# EasyEDA Pro project ProPrj_国赛G题输出板_2025-08-02.epro

# Schematic Schematic1
Board Name: Board1; Create Date: 2025-07-30; Page Name: P1; Project Name: 国赛G题输出板; Schematic Name: Schematic1; Update Date: 2025-07-31; Company: 嘉立创EDA; Page Size: A4; Version: V1.0
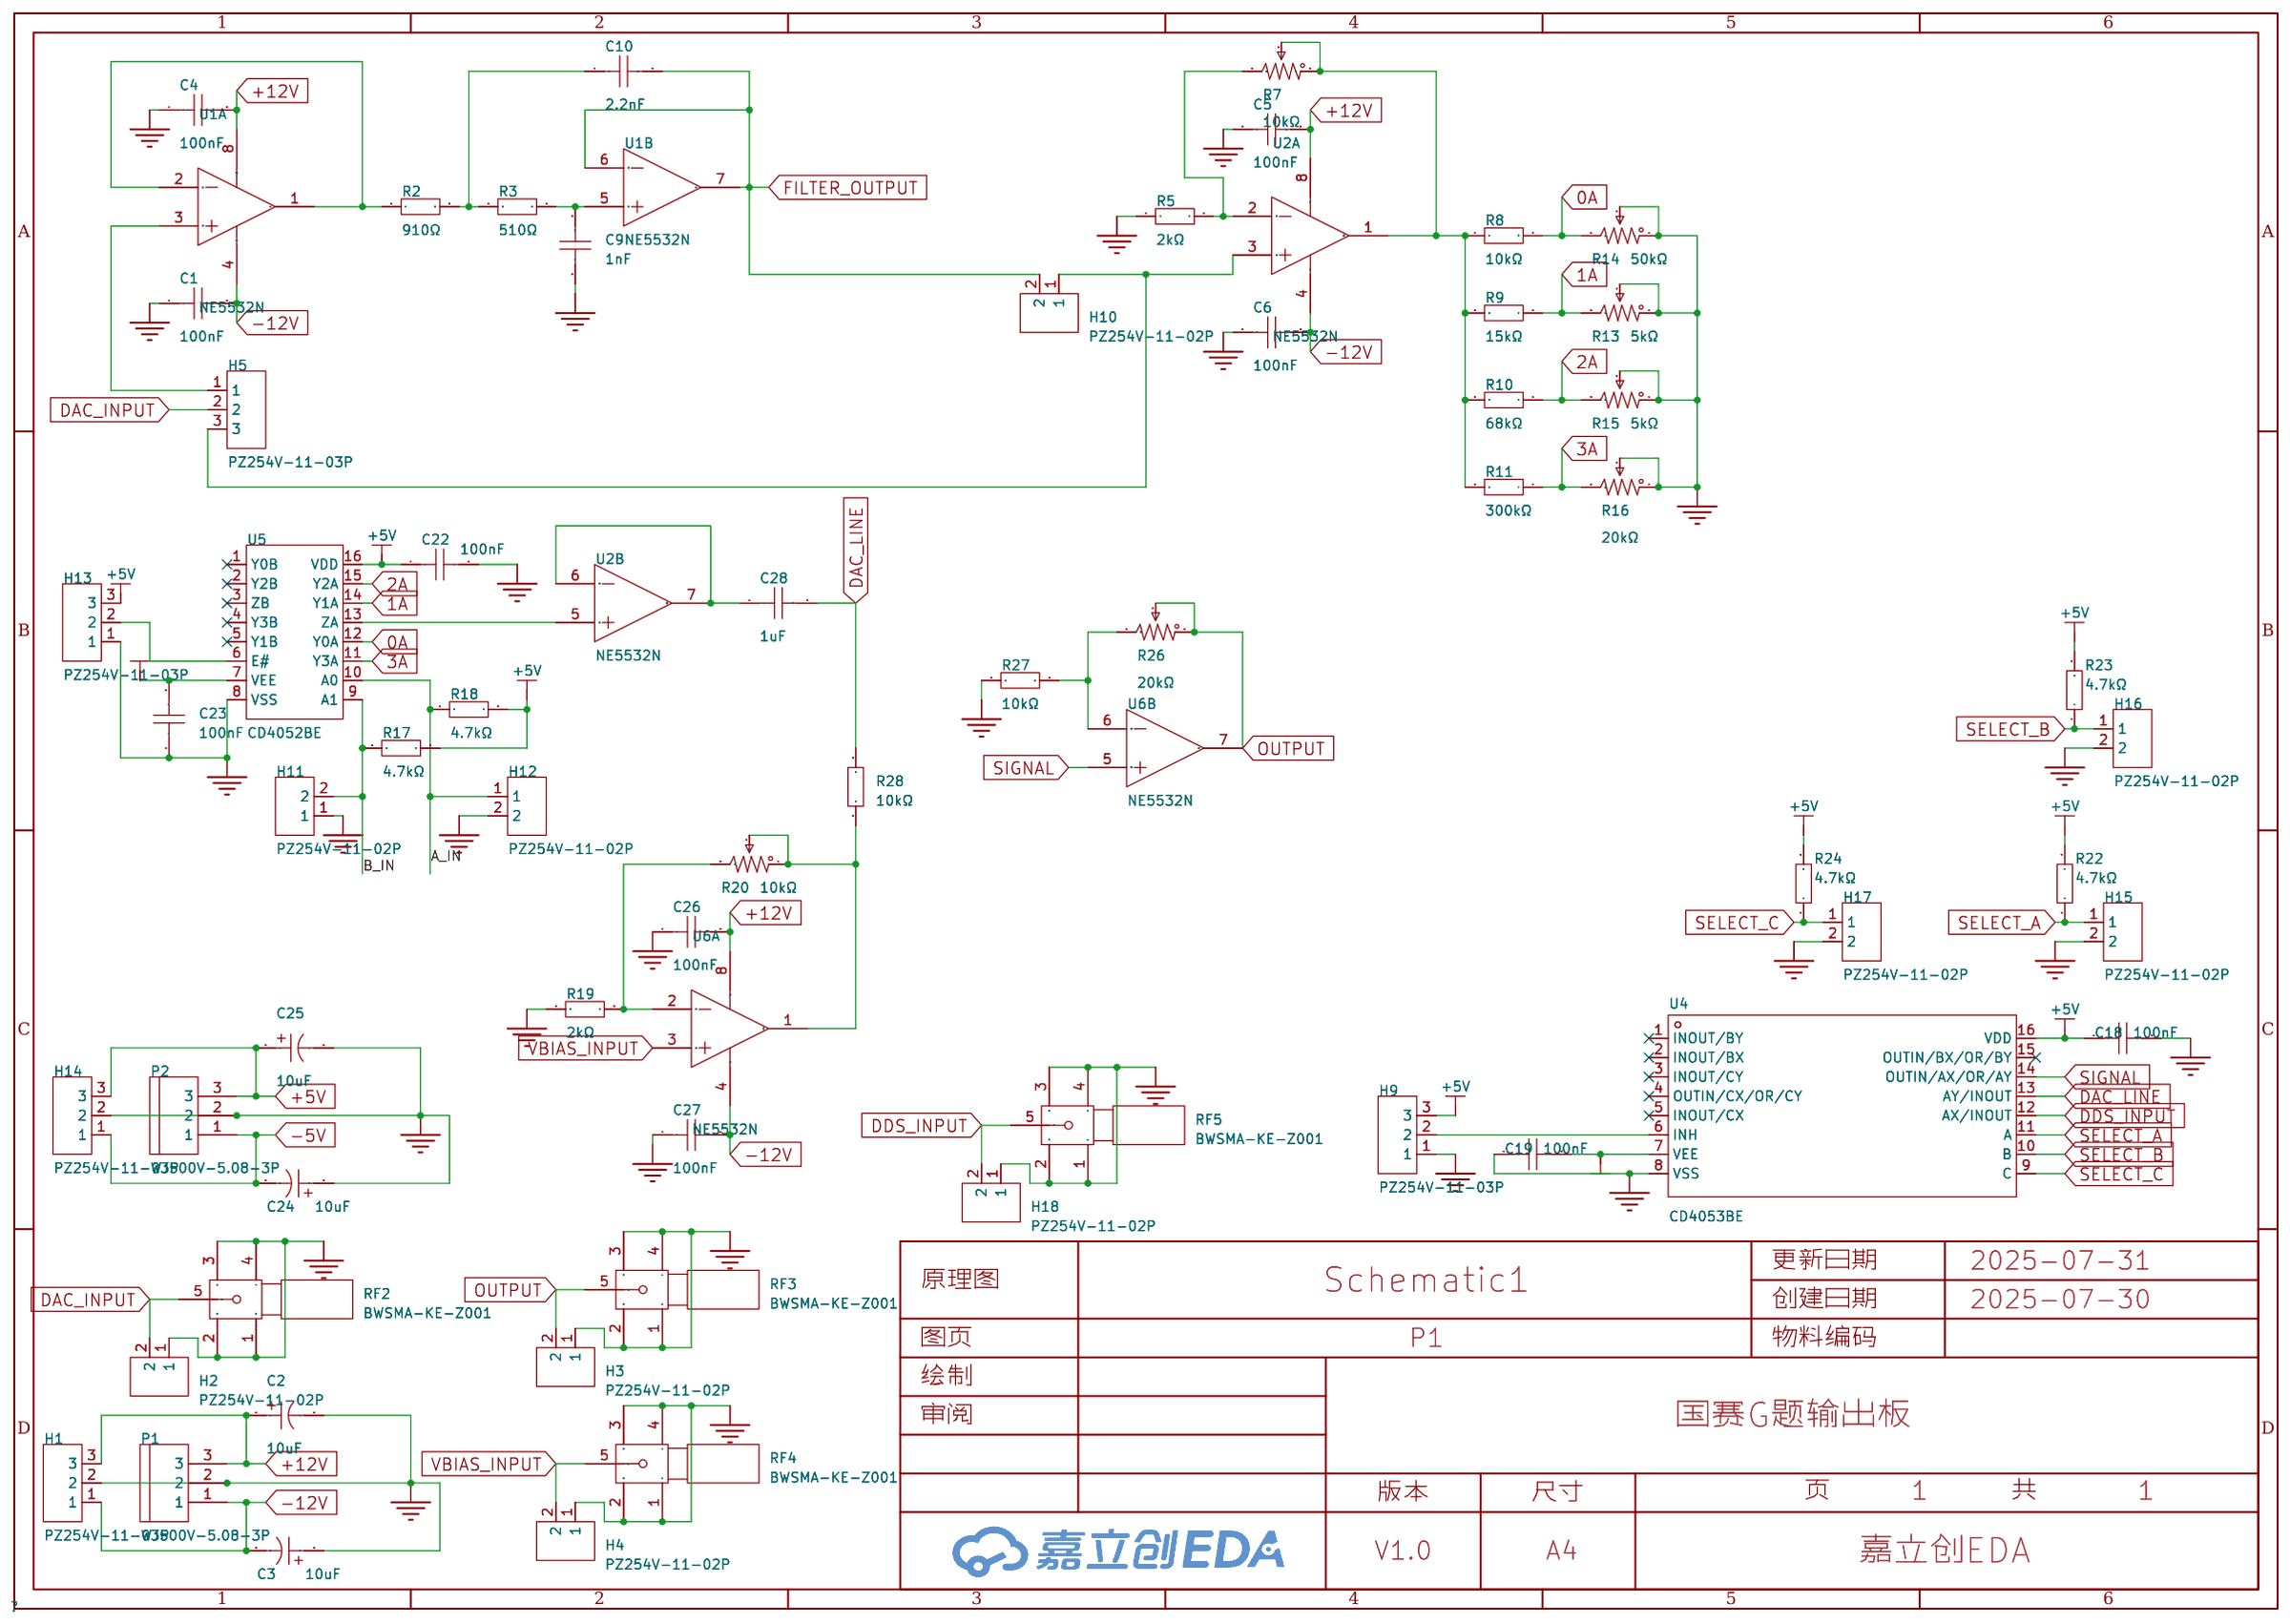
[diagram p0: schematic sheet]

## Parts
C1  100nF  [CAP-TH_L5.8-W2.4-P2.54-D0.6]
C2  10uF  [CAP-TH_BD10.0-P5.00-D0.6-FD_1]
C3  10uF  [CAP-TH_BD10.0-P5.00-D0.6-FD_1]
C4  100nF  [CAP-TH_L5.8-W2.4-P2.54-D0.6]
C5  100nF  [CAP-TH_L5.8-W2.4-P2.54-D0.6]
C6  100nF  [CAP-TH_L5.8-W2.4-P2.54-D0.6]
C9  1nF  [CAP-TH_L6.8-W2.6-P5.08-D0.6-S2.1]
C10  2.2nF  [CAP-TH_L6.0-W3.0-P5.00-D1.0]
C18  100nF  [CAP-TH_L5.0-W2.5-P5.00-D1.0]
C19  100nF  [CAP-TH_L5.0-W2.5-P5.00-D1.0]
C22  100nF  [CAP-TH_L5.8-W2.4-P2.54-D0.6]
C23  100nF  [CAP-TH_L5.8-W2.4-P2.54-D0.6]
C24  10uF  [CAP-TH_BD10.0-P5.00-D0.6-FD_1]
C25  10uF  [CAP-TH_BD10.0-P5.00-D0.6-FD_1]
C26  100nF  [CAP-TH_L5.8-W2.4-P2.54-D0.6]
C27  100nF  [CAP-TH_L5.8-W2.4-P2.54-D0.6]
C28  1uF  [CAP-TH_L5.5-W3.5-P5.00-D1.2]
H1  PZ254V-11-03P  [HDR-TH_3P-P2.54-V-M]
H2  PZ254V-11-02P  [HDR-TH_2P-P2.54-V-M]
H3  PZ254V-11-02P  [HDR-TH_2P-P2.54-V-M]
H4  PZ254V-11-02P  [HDR-TH_2P-P2.54-V-M]
H5  PZ254V-11-03P  [HDR-TH_3P-P2.54-V-M]
H9  PZ254V-11-03P  [HDR-TH_3P-P2.54-V-M]
H10  PZ254V-11-02P  [HDR-TH_2P-P2.54-V-M]
H11  PZ254V-11-02P  [HDR-TH_2P-P2.54-V-M]
H12  PZ254V-11-02P  [HDR-TH_2P-P2.54-V-M]
H13  PZ254V-11-03P  [HDR-TH_3P-P2.54-V-M]
H14  PZ254V-11-03P  [HDR-TH_3P-P2.54-V-M]
H15  PZ254V-11-02P  [HDR-TH_2P-P2.54-V-M]
H16  PZ254V-11-02P  [HDR-TH_2P-P2.54-V-M]
H17  PZ254V-11-02P  [HDR-TH_2P-P2.54-V-M]
H18  PZ254V-11-02P  [HDR-TH_2P-P2.54-V-M]
P1  WJ500V-5.08-3P  [CONN-TH_3P-P5.00_WJ500V-5.08-3P]
P2  WJ500V-5.08-3P  [CONN-TH_3P-P5.00_WJ500V-5.08-3P]
R2  910Ω  [Res_1/8W]
R3  510Ω  [Res_1/8W]
R5  2kΩ  [Res_1/8W]
R7  10kΩ  [RES-ADJ-TH_3P-L10.0-W10.0-P2.50-L]
R8  10kΩ  [Res_1/8W]
R9  15kΩ  [Res_1/8W]
R10  68kΩ  [Res_1/8W]
R11  300kΩ  [Res_1/8W]
R13  5kΩ  [RES-ADJ-TH_3P-L9.5-W4.85-P2.50-BL-BS]
R14  50kΩ  [RES-ADJ-TH_3P-L9.5-W4.85-P2.50-BL-BS]
R15  5kΩ  [RES-ADJ-TH_3P-L9.5-W4.85-P2.50-BL-BS]
R16  20kΩ  [RES-ADJ-TH_3P-L10.0-W10.0-P2.50-BL-BS]
R17  4.7kΩ  [Res_1/8W]
R18  4.7kΩ  [Res_1/8W]
R19  2kΩ  [Res_1/8W]
R20  10kΩ  [RES-ADJ-TH_3P-L10.0-W10.0-P2.50-L]
R22  4.7kΩ  [Res_1/8W]
R23  4.7kΩ  [Res_1/8W]
R24  4.7kΩ  [Res_1/8W]
R26  20kΩ  [RES-ADJ-TH_3P-L10.0-W10.0-P2.50-BL-BS]
R27  10kΩ  [Res_1/8W]
R28  10kΩ  [Res_1/8W]
RF2  BWSMA-KE-Z001  [SMA-TH_BWSMA-KE-Z001]
RF3  BWSMA-KE-Z001  [SMA-TH_BWSMA-KE-Z001]
RF4  BWSMA-KE-Z001  [SMA-TH_BWSMA-KE-Z001]
RF5  BWSMA-KE-Z001  [SMA-TH_BWSMA-KE-Z001]
U1  NE5532N  [DIP-8_L9.3-W6.4-P2.54-LS7.6-BL]  (sections 1,2)
U2  NE5532N  [DIP-8_L9.3-W6.4-P2.54-LS7.6-BL]  (sections 1,2)
U4  CD4053BE  [DIP-16_L20.3-W10.2-P2.54-LS10.2-BL]
U5  CD4052BE  [DIP-16_L20.0-W6.4-P2.54-LS7.6-BL]
U6  NE5532N  [DIP-8_L9.3-W6.4-P2.54-LS7.6-BL]  (sections 1,2)

## Library data of the parts
C1 C4-C6 C22 C23 C26 C27 = CC1H104ZA1ED3F5P1100: 容值:100nF;精度:-20%~+80%;额定电压:50V;温度系数:Y5V;; LCSC Part Name: 100nF -20%~+80% 50V; Supplier Part: C2832506; Manufacturer: Dersonic(德尔创); Supplier Footprint: 插件,P=2.54mm; JLCPCB Part Class: Extended Part; Datasheet: https://atta.szlcsc.com/upload/public/pdf/source/20211027/619020FDD8EBC9BBFCA73A5584FA164D.pdf; Supplier: LCSC; Tolerance: -20%~+80%; Voltage Rated: 50V; Lead Spacing: 2.54mm; Temperature Coefficient: Y5V; φD: 5.8mm; Body Thickness: 2.4mm
C2 C3 C24 C25 = ERG450V10M10x16: 容值:10uF;精度:±20%;额定电压:450V;纹波电流:100mA@100kHz;等效串联电阻(ESR):9.45Ω@100kHz;; LCSC Part Name: 10uF ±20% 450V; Supplier Part: C46552835; Manufacturer: 捷而瑞; Supplier Footprint: 插件,D10xL16mm; JLCPCB Part Class: Extended Part; Datasheet: https://atta.szlcsc.com/upload/public/pdf/source/20250526/717B4C76834FE5C4A331D19A222D031C.pdf; Supplier: LCSC; Tolerance: ±20%; Voltage Rating: 450V; Ripple Current: 100mA@100kHz; Equivalent Series Resistance(ESR): 9.45Ω@100kHz; Pin Spacing: 5mm; Diameter: 10mm; Height - Seated (Max): 16mm; Lifetime: 2000hrs@105℃; Operating Temperature: -25℃~+105℃
C9 = CC3D102KC2IEB46U31MF: 容值:1nF;精度:±10%;额定电压:2kV;温度系数:Y5P;; LCSC Part Name: 1nF ±10% 2kV; Supplier Part: C2976624; Manufacturer: Dersonic(德尔创); Supplier Footprint: 插件,P=5.08mm; JLCPCB Part Class: 扩展库; Datasheet: https://atta.szlcsc.com/upload/public/pdf/source/20220304/B30716485B36DF2A2600FFFEA050A940.pdf; Supplier: LCSC; Tolerance: ±10%; Voltage Rating: 2kV; Pin Spacing: 5.08mm; Temperature Coefficient: Y5P; Diameter: 6.8mm; Body Thickness: 2.6mm
C10 = R06F1B222MN0B0S0N0: 容值:2.2nF;精度:±20%;额定电压:2kV;温度系数:Y5V;; LCSC Part Name: 2.2nF ±20% 2kV; Supplier Part: C249167; Manufacturer: STE(松田); Supplier Footprint: 插件,P=5mm; JLCPCB Part Class: 扩展库; Datasheet: https://atta.szlcsc.com/upload/public/pdf/source/20190806/C366874_7FA13009B587FE73099181E533DD7411.pdf; Supplier: LCSC; Tolerance: ±20%; Voltage Rating: 2kV; Pin Spacing: 5mm; Temperature Coefficient: Y5V; Diameter: 6mm; Body Thickness: 3mm
C18 C19 = CC1H104MC1FD3F6C10MF: 容值:100nF;精度:±20%;额定电压:50V;温度系数:Y5V;; LCSC Part Name: 100nF ±20% 50V; Supplier Part: C254085; Manufacturer: Dersonic(德尔创); Supplier Footprint: 插件,P=5.08mm; JLCPCB Part Class: 扩展库; Datasheet: https://atta.szlcsc.com/upload/public/pdf/source/20200826/C254085_159DD65BF32BF11C9168D341BCE23E6F.pdf; Supplier: LCSC; Tolerance: ±20%; Voltage Rating: 50V; Pin Spacing: 5.08mm; Temperature Coefficient: Y5V; Diameter: 6mm; Body Thickness: 2.2mm
C28 = FK26X7R1H105KRE06: 容值:1uF;精度:±10%;额定电压:50V;温度系数:X7R;; LCSC Part Name: 1uF ±10% 50V; Supplier Part: C2839237; Manufacturer: TDK; Supplier Footprint: 插件,P=5mm; JLCPCB Part Class: 扩展库; Datasheet: https://atta.szlcsc.com/upload/public/pdf/source/20211011/CA0C243CD946D294CDFF83D03DB16AD9.pdf; Supplier: LCSC; Tolerance: ±10%; Voltage Rating: 50V; Pin Spacing: 5mm; Temperature Coefficient: X7R
H1 H5 H9 H13 H14 = PZ254V-11-03P: 插针结构:1x3P;间距:2.54mm;行距:-;圆针/方针:方针;安装方式:直插;排数:单排;总PIN位数:3P;额定电流:3A;额定电压:250V;配合针长度:6mm;塑高:2.5mm;端接针长度:3mm;工作温度:-40℃~+105℃;颜色:黑色;; LCSC Part Name: 1x3P 间距:2.54mm 方针 直插; Supplier Part: C2937625; Manufacturer: XFCN(兴飞); Supplier Footprint: 插件,P=2.54mm; JLCPCB Part Class: 扩展库; Datasheet: https://atta.szlcsc.com/upload/public/pdf/source/20200309/C492402_8335C3D49C4E4C618838D59BB1D024C1.pdf; Supplier: LCSC; Pin Structure: 1x3P; Pitch: 2.54mm; Circluar Pins/Square Pins: 方针; Mounting Type: 直插; Number of Rows: 单排; Number of Pins: 3P; Current Rating: 3A; Voltage Rating (Max): 250V; Length of Mating Pin: 6mm; Insulation Height: 2.5mm; Length of End Connection Pin: 3mm; Operating Temperature: -40℃~+105℃; Color: 黑色
H2-H4 H10-H12 H15-H18 = PZ254V-11-02P: 插针结构:1x2P;间距:2.54mm;行距:-;圆针/方针:方针;安装方式:直插;排数:单排;总PIN位数:2P;额定电流:-;额定电压:-;配合针长度:6mm;塑高:2.5mm;端接针长度:3mm;触头材质:黄铜;触头镀层:-;工作温度:-40℃~+105℃;颜色:黑色;; LCSC Part Name: 1x2P 间距:2.54mm 方针 直插; Supplier Part: C492401; Manufacturer: XFCN(兴飞); Supplier Footprint: 插件,P=2.54mm; JLCPCB Part Class: 扩展库; Datasheet: https://atta.szlcsc.com/upload/public/pdf/source/20200309/C492401_A812433581A9B211A7FFA413ADDFF0E5.pdf; Supplier: LCSC; Pin Structure: 1x2P; Pitch: 2.54mm; Circluar Pins/Square Pins: 方针; Mounting Type: 直插; Number of Rows: 单排; Number of Pins: 2P; Length of Mating Pin: 6mm; Insulation Height: 2.5mm; Length of End Connection Pin: 3mm; Contact Material: 黄铜; Operating Temperature: -40℃~+105℃; Color: 黑色
P1 P2 = WJ500V-5.08-3P: 结构:1x3P;间距:5.08mm;颜色:绿色;安装方式:直插;额定电流:18A;额定电压:250V;排数:1;线规 - AWG:14~30;线规 - 平方毫米:2.5;每排PIN数:3;工作温度范围:-40℃~+105℃;; LCSC Part Name: 5.08mm 1x3P 排数:1 每排P数:3 直插; Supplier Part: C72334; Manufacturer: KANGNEX(康奈克斯电气); Supplier Footprint: 插件,P=5.08mm; JLCPCB Part Class: 扩展库; Datasheet: https://atta.szlcsc.com/upload/public/pdf/source/20191225/C72334_8A5EF831D67650233B6B1E3F2BC06274.pdf; Supplier: LCSC; Structure: 1x3P; Pitch: 5.08mm; Color: 绿色; Mounting Style: 直插; Current Rating (Max): 18A; Voltage Rating (Max): 250V; Number of Pins: 3P; Number of Rows: 1; Wire Gauge - AWG: 14~30; Wire Gauge - mm2: 2.5; Number of PINs Per Row: 3; Operating Temperature Range: -40℃~+105℃
R2 R3 R5 R8-R11 R17-R19 R22-R24 R27 R28 = Res_AXIAL-1/8W: Supplier Footprint: 轴向引线
R7 R20 = 3296W-1-103: 阻值:10kΩ;精度:±10%;; LCSC Part Name: 10kΩ ±10%; Supplier Part: C118954; Manufacturer: BOCHEN(博晨); Supplier Footprint: 插件; JLCPCB Part Class: 扩展库; Datasheet: https://atta.szlcsc.com/upload/public/pdf/source/20171114/C118954_15106326646611117443.pdf; Supplier: LCSC; Tolerance: ±10%
R13 R15 = 3296W-1-502: 阻值:5kΩ;精度:±10%;; LCSC Part Name: 5kΩ ±10%; Supplier Part: C118907; Manufacturer: BOCHEN(博晨); Supplier Footprint: 插件; JLCPCB Part Class: 扩展库; Datasheet: https://atta.szlcsc.com/upload/public/pdf/source/20171114/C118907_15106326547951117397.pdf; Supplier: LCSC; Tolerance: ±10%
R14 = 3296W-1-503: 阻值:50kΩ;精度:±10%;; LCSC Part Name: 50kΩ ±10%; Supplier Part: C118911; Manufacturer: BOCHEN(博晨); Supplier Footprint: 插件; JLCPCB Part Class: 扩展库; Datasheet: https://atta.szlcsc.com/upload/public/pdf/source/20171114/C118911_15106326557211117401.pdf; Supplier: LCSC; Tolerance: ±10%
R16 R26 = 3296W-1-203: 阻值:20kΩ;精度:±10%;; LCSC Part Name: 20kΩ ±10%; Supplier Part: C118936; Manufacturer: BOCHEN(博晨); Supplier Footprint: 插件; JLCPCB Part Class: 扩展库; Datasheet: https://atta.szlcsc.com/upload/public/pdf/source/20171114/C118936_15106326608611117425.pdf; Supplier: LCSC; Tolerance: ±10%
RF2-RF5 = BWSMA-KE-Z001_C496549: 连接器类型:板端;接口类型:内孔;端口数量:1;接口直径:-;接口长度/高度:-;频率-最大值:-;射频系列:SMA;阻抗:50Ω;样式:正脚;触头材质:-;触头镀层:-;工作温度范围:-65℃~+165℃;焊接温度(最大值):-;; LCSC Part Name: 内孔 SMA 正脚; Supplier Part: C496549; Manufacturer: BAT WIRELESS(蝙蝠无线); Supplier Footprint: 插件; JLCPCB Part Class: 扩展库; Datasheet: https://atta.szlcsc.com/upload/public/pdf/source/20221228/40BF41E56A06003A0210E1785CA66EA6.pdf; Supplier: LCSC; Connector Type: 板端; Interface Type: 内孔; Number of Ports: 1; RF Series: SMA; Impedance: 50Ω; Style: 正脚; Operating Temperature Range: -65℃~+165℃
U1 U2 U6 = NE5532N: 放大器数:双路;轨到轨:-;增益带宽积(GBP):10MHz;输入失调电压(Vos):5mV;压摆率(SR):11V/us;输入偏置电流(Ib):500nA;; Supplier Part: C2987282; Manufacturer: HGSEMI(华冠); Supplier Footprint: DIP-8; JLCPCB Part Class: 扩展库; Datasheet: https://atta.szlcsc.com/upload/public/pdf/source/20220420/2D3D2D023E04B50C3DA859F976397601.pdf; Supplier: LCSC; Number of Channels: 双路; Maximum Power Supply Range (Vdd-Vss): 44V; Gain Bandwidth Product: 10MHz; Vos - Input Offset Voltage: 5mV; Slew Rate: 11V/us; Ib - Input Bias Current: 500nA; Input Offset Current(Ios): 200nA; Noise density(eN): 8nV/√Hz@1kHz; Common Mode Rejection Ratio(CMRR): 100dB; Operating Temperature: 0℃~+70℃; Dual Supply: ±22V
U4 = CD4053BE: 开关电路:单刀双掷(SPDT);通道数:-;导通电阻:5Ω;; LCSC Part Name: CMOS模拟多路复用器/解复用器; Supplier Part: C5202; Manufacturer: TI(德州仪器); Supplier Footprint: PDIP-16; JLCPCB Part Class: 扩展库; Datasheet: https://www.ti.com/cn/lit/gpn/cd4051b; Supplier: LCSC; Switch Circuit: 单刀双掷(SPDT); Voltage - Supply: 3V~20V; RDS(on): 5Ω; Operating Temperature: -55℃~+125℃
U5 = CD4052BE_C507162: 开关电路:单刀四掷(SP4T);通道数:4;导通电阻:60Ω;; LCSC Part Name: CD4052B 模拟开关; Supplier Part: C507162; Manufacturer: HGSEMI(华冠); Supplier Footprint: DIP-16; JLCPCB Part Class: 扩展库; Datasheet: https://atta.szlcsc.com/upload/public/pdf/source/20240320/CC91619F245F93C5280634F2EA8C8572.pdf; Supplier: LCSC; Switch Circuit: 单刀四掷(SP4T); Number of Channels: 4; Voltage - Supply: 3V~15V; RDS(on): 60Ω; Operating Temperature: -40℃~+85℃

## Nets
+5V: C18.1 C22.1 C25.1 H9.3 H13.3 H14.3 P2.3 R17.1 R18.2 R22.2 R23.2 R24.2 U4.16(VDD) U5.16(VDD)
+12V: C2.1 C4.2 C5.2 C26.2 H1.3 P1.3 U1.8(VCC+) U2.8(VCC+) U6.8(VCC+)
-5V: C19.2 C23.2 C24.2 H14.1 P2.1 U4.7(VEE) U5.7(VEE)
-12V: C1.2 C3.2 C6.2 C27.2 H1.1 P1.1 U1.4(VCC-) U2.4(VCC-) U6.4(VCC-)
GND: C1.1 C2.2 C3.1 C4.1 C5.1 C6.1 C9.1 C18.2 C19.1 C22.2 C23.1 C24.1 C25.2 C26.1 C27.1 H1.2 H2.1 H3.1 H4.1 H9.1 H11.1 H12.2 H13.1 H14.2 H15.2 H16.2 H17.2 H18.1 P1.2 P2.2 R5.1 R13.1 R13.2 R14.1 R14.2 R15.1 R15.2 R16.1 R16.2 R19.1 R27.1 RF2.1 RF2.2 RF2.3 RF2.4 RF3.1 RF3.2 RF3.3 RF3.4 RF4.1 RF4.2 RF4.3 RF4.4 RF5.1 RF5.2 RF5.3 RF5.4 U4.8(VSS) U5.8(VSS)
0A: R8.2 R14.3 U5.12(Y0A)
1A: R9.1 R13.3 U5.14(Y1A)
2A: R10.1 R15.3 U5.15(Y2A)
3A: R11.1 R16.3 U5.11(Y3A)
A_IN: H12.1 R18.1 U5.10(A0)
B_IN: H11.2 R17.2 U5.9(A1)
DAC_INPUT: H2.2 H5.2 RF2.5
DAC_LINE: C28.2 R28.2 U4.13(AY/INOUT)
DDS_INPUT: H18.2 RF5.5 U4.12(AX/INOUT)
FILTER_OUTPUT: C10.2 H10.2 U1.6(IN2-) U1.7(OUT2)
OUTPUT: H3.2 R26.1 R26.2 RF3.5 U6.7(OUT2)
SELECT_A: H15.1 R22.1 U4.11(A)
SELECT_B: H16.1 R23.1 U4.10(B)
SELECT_C: H17.1 R24.1 U4.9(C)
SIGNAL: U4.14(OUTIN/AX/OR/AY) U6.5(IN2+)
VBIAS_INPUT: H4.2 RF4.5 U6.3(IN1+)
$1N2172: R2.1 U1.1(OUT1) U1.2(IN1-)
$1N2176: C10.1 R2.2 R3.1
$1N2201: C9.2 R3.2 U1.5(IN2+)
$1N2440: H5.1 U1.3(IN1+)
$1N4655: R5.2 R7.3 U2.2(IN1-)
$1N4662: R7.1 R7.2 R8.1 R9.2 R10.2 R11.2 U2.1(OUT1)
$1N4663: C28.1 U2.6(IN2-) U2.7(OUT2)
$1N4664: H5.3 H10.1 U2.3(IN1+)
$1N4683: H9.2 U4.6(INH)
$1N5505: H13.2 U5.6(E#)
$1N6257: U2.5(IN2+) U5.13(ZA)
$1N7259: R19.2 R20.3 U6.2(IN1-)
$1N7273: R20.1 R20.2 R28.1 U6.1(OUT1)
$1N8069: R26.3 R27.2 U6.6(IN2-)

Not connected (* = marked no-connect by the designer): U4 1(INOUT/BY)* 2(INOUT/BX)* 3(INOUT/CY)* 4(OUTIN/CX/OR/CY)* 5(INOUT/CX)* 15(OUTIN/BX/OR/BY)*; U5 1(Y0B)* 2(Y2B)* 3(ZB)* 4(Y3B)* 5(Y1B)*

# Board PCB1
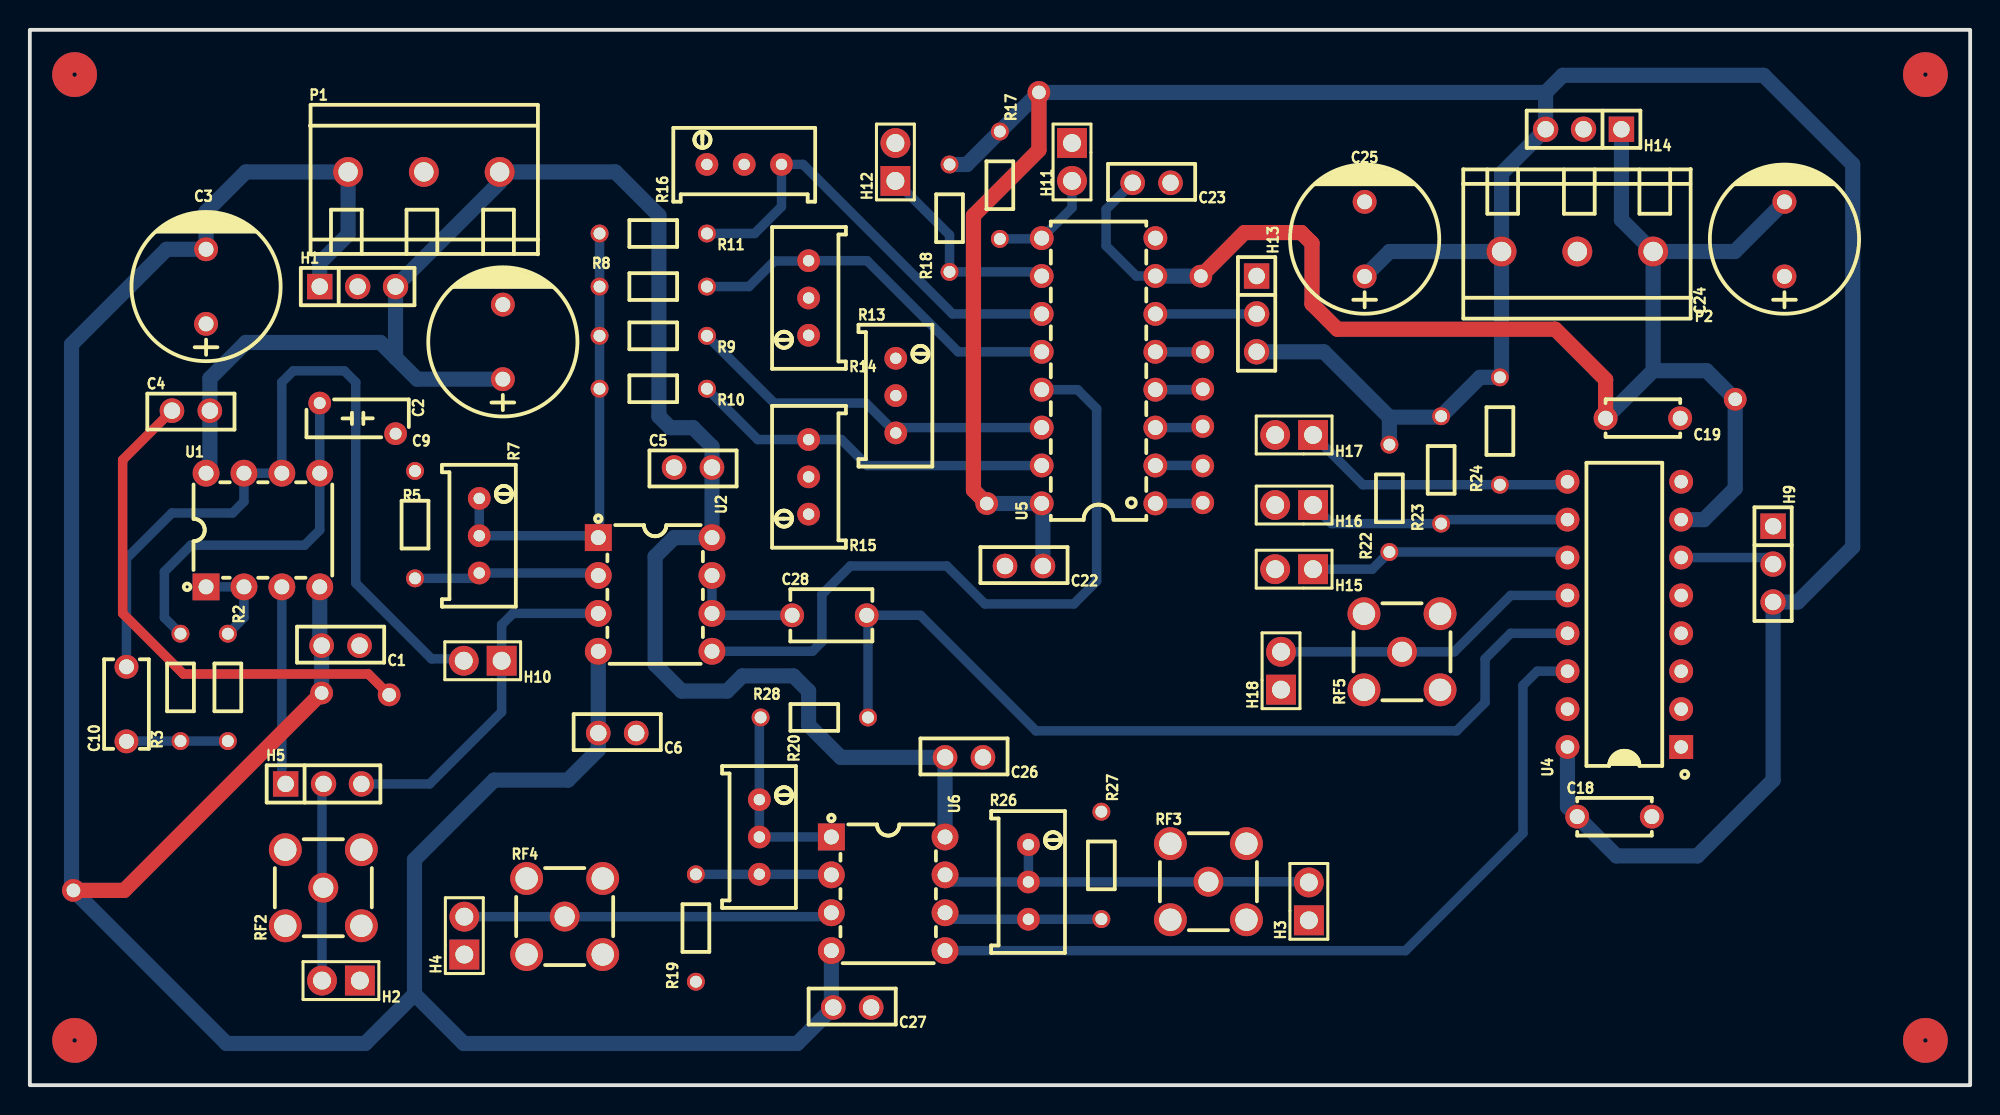
[diagram p1: board, top side]
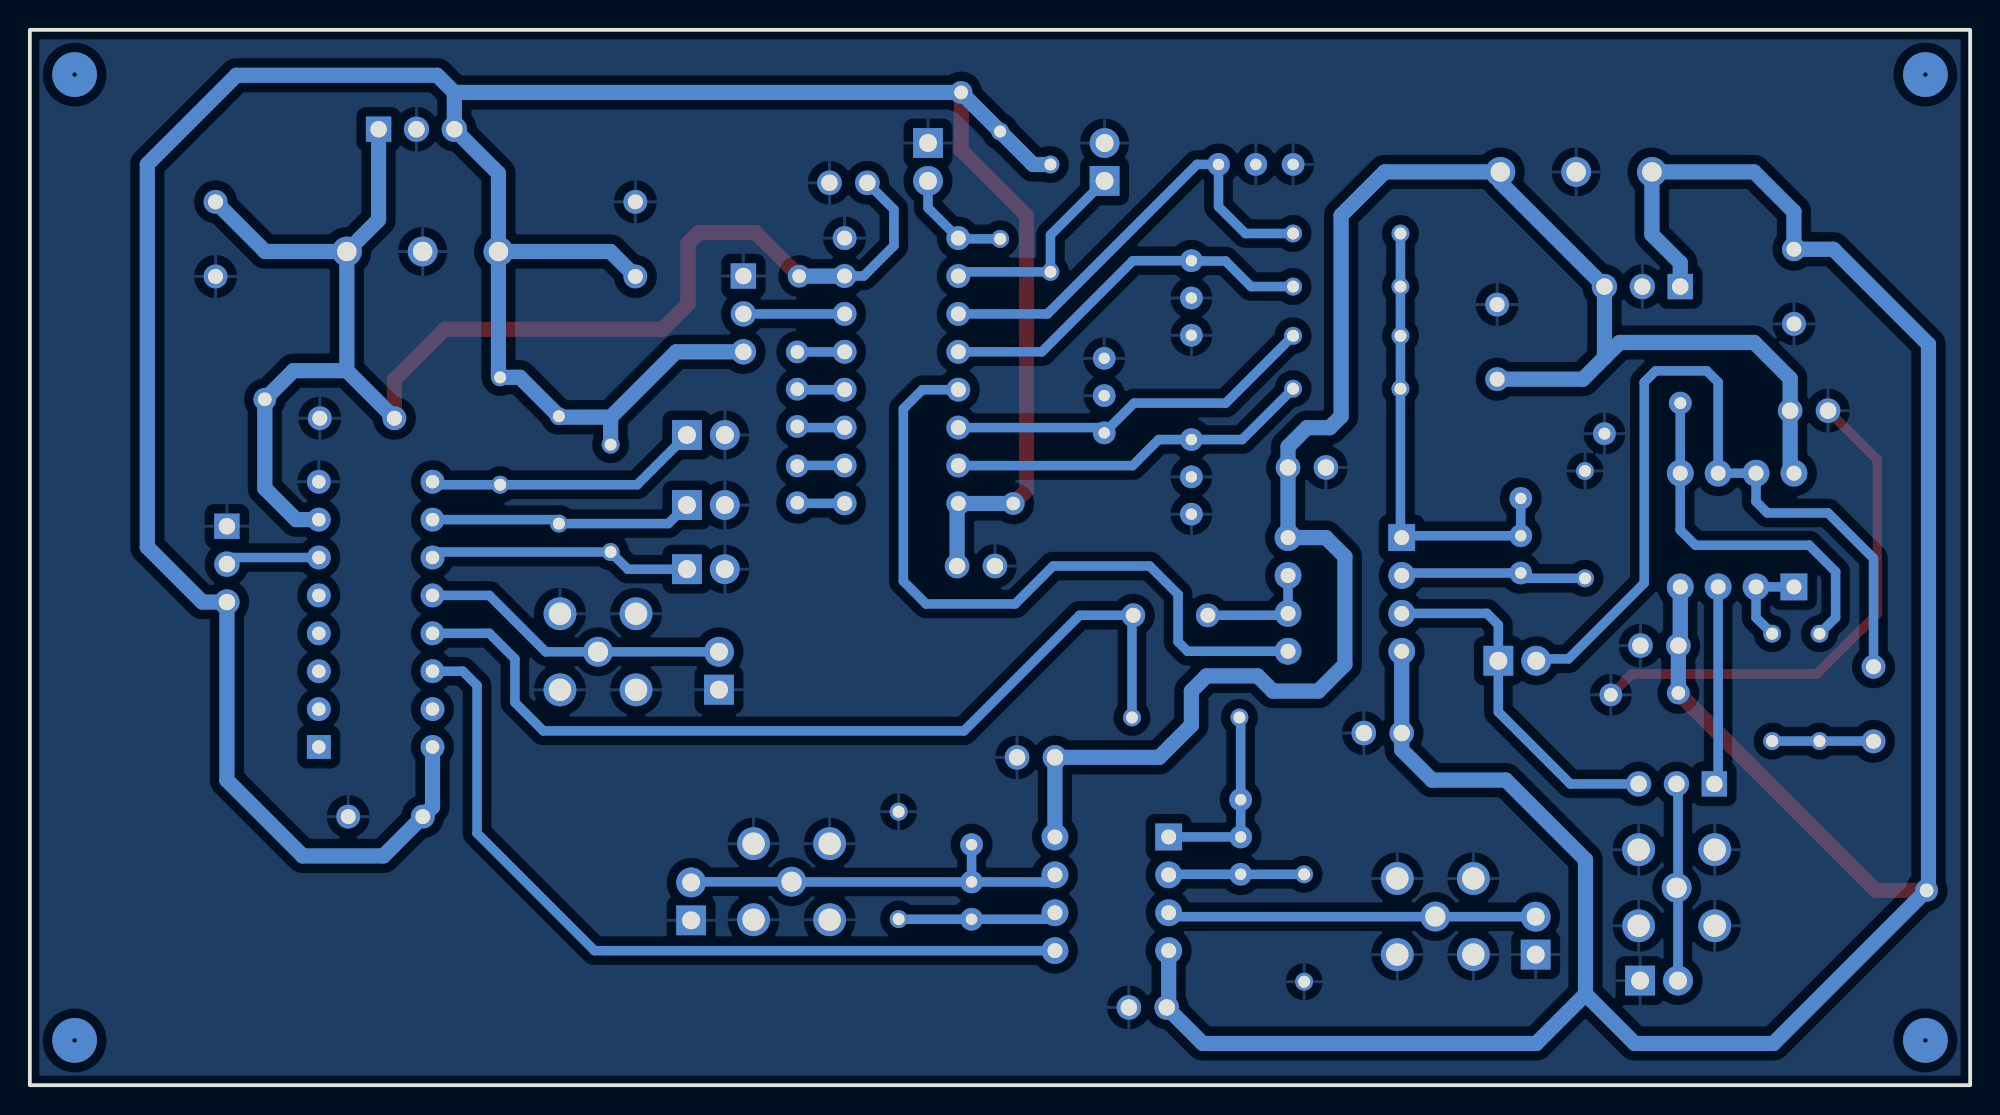
[diagram p2: board, bottom side, seen from below]

Outline 130.05 x 70.74 mm; copper layers: Top Layer, Bottom Layer. Coordinates in mm from the lower left corner of the outline.
Outline path: rectangle 0,70.74 130.05,0
Stack: Top Layer 0.035mm / Dielectric1 1.51mm FR4 er 4.5 / Bottom Layer 0.035mm

## Design rules (mm)
template: 自定义配置
spacing copperThickness1oz (default): track to track 0.102, other pairs 0.152 to 0.3
spacing copperThickness2oz: track to track 0.203, other pairs 0.152 to 0.3
track width copperThickness1oz (default): min 0.127, default 0.254, max 2.54
track width copperThickness2oz: min 0.203, default 0.254, max 2.54
differential pair differentialPair (default): width min 0.127, default 0.254, max 2.54; gap min 0.152, default 0.152
via viaSize (default): diameter min 0.5, default 0.61, max 10; hole min 0.3, default 0.305, max 6.3

## Placement (name value [footprint] x y rotation side)
C1  100nF  [CAP-TH_L5.8-W2.4-P2.54-D0.6]  20.83 29.46 180 top
C2  10uF  [CAP-TH_BD10.0-P5.00-D0.6-FD_1]  31.7 49.82 90 top
C3  10uF  [CAP-TH_BD10.0-P5.00-D0.6-FD_1]  11.81 53.53 90 top
C4  100nF  [CAP-TH_L5.8-W2.4-P2.54-D0.6]  10.8 45.21 0 top
C5  100nF  [CAP-TH_L5.8-W2.4-P2.54-D0.6]  44.45 41.4 0 top
C6  100nF  [CAP-TH_L5.8-W2.4-P2.54-D0.6]  39.37 23.6 180 top
C9  1nF  [CAP-TH_L6.8-W2.6-P5.08-D0.6-S2.1]  21.97 44.7 180 top
C10  2.2nF  [CAP-TH_L6.0-W3.0-P5.00-D1.0]  6.48 25.55 90 top
C18  100nF  [CAP-TH_L5.0-W2.5-P5.00-D1.0]  106.21 18 0 top
C19  100nF  [CAP-TH_L5.0-W2.5-P5.00-D1.0]  108.11 44.7 180 top
C22  100nF  [CAP-TH_L5.8-W2.4-P2.54-D0.6]  66.63 34.8 180 top
C23  100nF  [CAP-TH_L5.8-W2.4-P2.54-D0.6]  75.18 60.48 180 top
C24  10uF  [CAP-TH_BD10.0-P5.00-D0.6-FD_1]  117.6 56.71 90 top
C25  10uF  [CAP-TH_BD10.0-P5.00-D0.6-FD_1]  89.46 56.71 90 top
C26  100nF  [CAP-TH_L5.8-W2.4-P2.54-D0.6]  62.61 21.97 180 top
C27  100nF  [CAP-TH_L5.8-W2.4-P2.54-D0.6]  55.12 5.21 180 top
C28  1uF  [CAP-TH_L5.5-W3.5-P5.00-D1.2]  53.59 31.5 0 top
H1  PZ254V-11-03P  [HDR-TH_3P-P2.54-V-M]  21.97 53.53 0 top
H2  PZ254V-11-02P  [HDR-TH_2P-P2.54-V-M]  20.85 7.01 180 top
H3  PZ254V-11-02P  [HDR-TH_2P-P2.54-V-M]  85.72 12.32 90 top
H4  PZ254V-11-02P  [HDR-TH_2P-P2.54-V-M]  29.12 10.02 90 top
H5  PZ254V-11-03P  [HDR-TH_3P-P2.54-V-M]  19.69 20.19 0 top
H9  PZ254V-11-03P  [HDR-TH_3P-P2.54-V-M]  116.84 34.93 270 top
H10  PZ254V-11-02P  [HDR-TH_2P-P2.54-V-M]  30.35 28.45 180 top
H11  PZ254V-11-02P  [HDR-TH_2P-P2.54-V-M]  69.85 61.88 270 top
H12  PZ254V-11-02P  [HDR-TH_2P-P2.54-V-M]  58.01 61.88 90 top
H13  PZ254V-11-03P  [HDR-TH_3P-P2.54-V-M]  82.22 51.7 270 top
H14  PZ254V-11-03P  [HDR-TH_3P-P2.54-V-M]  104.13 64.08 180 top
H15  PZ254V-11-02P  [HDR-TH_2P-P2.54-V-M]  84.74 34.59 180 top
H16  PZ254V-11-02P  [HDR-TH_2P-P2.54-V-M]  84.74 38.89 180 top
H17  PZ254V-11-02P  [HDR-TH_2P-P2.54-V-M]  84.74 43.58 180 top
H18  PZ254V-11-02P  [HDR-TH_2P-P2.54-V-M]  83.86 27.78 90 top
NOREF  -  [Pad_e482]  78.49 54.23 0 top
NOREF#2  -  [Pad_e71]  78.61 41.51 0 top
NOREF#3  -  [Pad_e1867]  24.08 26.16 0 top
NOREF#4  -  [Pad_e69]  78.61 46.65 0 top
NOREF#5  -  [Pad_e72]  78.61 39.04 0 top
NOREF#6  -  [Pad_e497]  67.63 66.54 0 top
NOREF#7  -  [Pad_e70]  78.61 44.15 0 top
NOREF#8  -  [Pad_e478]  19.56 26.29 0 top
NOREF#9  -  [Pad_e68]  78.61 49.15 0 top
NOREF#10  -  [Pad_e507]  114.3 45.97 0 top
NOREF#11  -  [Pad_e493]  2.92 13.06 0 top
NOREF#12  -  [Pad_e480]  64.13 38.99 0 top
P1  WJ500V-5.08-3P  [CONN-TH_3P-P5.00_WJ500V-5.08-3P]  26.41 61.21 0 top
P2  WJ500V-5.08-3P  [CONN-TH_3P-P5.00_WJ500V-5.08-3P]  103.72 55.88 180 top
R2  910Ω  [Res_1/8W]  13.21 26.66 270 top
R3  510Ω  [Res_1/8W]  10.16 26.66 90 top
R5  2kΩ  [Res_1/8W]  25.75 37.57 270 top
R7  10kΩ  [RES-ADJ-TH_3P-L10.0-W10.0-P2.50-L]  30.12 36.83 270 top
R8  10kΩ  [Res_1/8W]  41.78 53.47 0 top
R9  15kΩ  [Res_1/8W]  41.78 50.29 180 top
R10  68kΩ  [Res_1/8W]  41.78 46.75 180 top
R11  300kΩ  [Res_1/8W]  41.78 57.15 180 top
R13  5kΩ  [RES-ADJ-TH_3P-L9.5-W4.85-P2.50-BL-BS]  58.04 46.22 0 top
R14  50kΩ  [RES-ADJ-TH_3P-L9.5-W4.85-P2.50-BL-BS]  52.2 52.76 180 top
R15  5kΩ  [RES-ADJ-TH_3P-L9.5-W4.85-P2.50-BL-BS]  52.2 40.78 180 top
R16  20kΩ  [RES-ADJ-TH_3P-L10.0-W10.0-P2.50-BL-BS]  47.88 61.72 90 top
R17  4.7kΩ  [Res_1/8W]  64.95 60.33 270 top
R18  4.7kΩ  [Res_1/8W]  61.71 58.11 90 top
R19  2kΩ  [Res_1/8W]  44.7 10.53 90 top
R20  10kΩ  [RES-ADJ-TH_3P-L10.0-W10.0-P2.50-L]  48.9 16.64 270 top
R22  4.7kΩ  [Res_1/8W]  91.19 39.34 90 top
R23  4.7kΩ  [Res_1/8W]  94.65 41.24 90 top
R24  4.7kΩ  [Res_1/8W]  98.59 43.85 90 top
R26  20kΩ  [RES-ADJ-TH_3P-L10.0-W10.0-P2.50-BL-BS]  66.93 13.62 0 top
R27  10kΩ  [Res_1/8W]  71.75 14.73 270 top
R28  10kΩ  [Res_1/8W]  52.58 24.59 0 top
RF2  BWSMA-KE-Z001  [SMA-TH_BWSMA-KE-Z001]  19.67 13.23 90 top
RF3  BWSMA-KE-Z001  [SMA-TH_BWSMA-KE-Z001]  78.99 13.64 0 top
RF4  BWSMA-KE-Z001  [SMA-TH_BWSMA-KE-Z001]  35.85 11.3 0 top
RF5  BWSMA-KE-Z001  [SMA-TH_BWSMA-KE-Z001]  91.97 29.05 90 top
U1  NE5532N  [DIP-8_L9.3-W6.4-P2.54-LS7.6-BL]  15.62 37.21 0 top
U2  NE5532N  [DIP-8_L9.3-W6.4-P2.54-LS7.6-BL]  41.91 32.89 270 top
U4  CD4053BE  [DIP-16_L20.3-W10.2-P2.54-LS10.2-BL]  106.87 31.56 90 top
U5  CD4052BE  [DIP-16_L20.0-W6.4-P2.54-LS7.6-BL]  71.63 47.89 90 top
U6  NE5532N  [DIP-8_L9.3-W6.4-P2.54-LS7.6-BL]  57.53 12.83 270 top

## Footprints (pads in the part's own frame, mm; a bottom-side part is the same pattern mirrored in y, then rotated)
CAP-TH_BD10.0-P5.00-D0.6-FD_1
  round 1.6 hole 1: 1(-2.5,0) 2(2.5,0)
CAP-TH_L5.0-W2.5-P5.00-D1.0
  round 1.6 hole 1: 1(-2.5,0) 2(2.5,0)
CAP-TH_L5.5-W3.5-P5.00-D1.2
  round 1.6 hole 1: 1(-2.5,0) 2(2.5,0)
CAP-TH_L5.8-W2.4-P2.54-D0.6
  round 1.65 hole 1.1: 1(-1.27,0) 2(1.27,0)
CAP-TH_L6.0-W3.0-P5.00-D1.0
  round 1.6 hole 1: 1(-2.5,0) 2(2.5,0)
CAP-TH_L6.8-W2.6-P5.08-D0.6-S2.1
  round 1.524 hole 0.8: 1(-2.542,1.025) 2(2.542,-1.025)
CONN-TH_3P-P5.00_WJ500V-5.08-3P
  round 2 hole 1.3: 1(-5.08,0) 2(0,0) 3(5.08,0)
DIP-8_L9.3-W6.4-P2.54-LS7.6-BL
  rect 1.8x1.8 hole 1: 1(-3.81,-3.81)
  round 1.8 hole 1: 2(-1.27,-3.81) 3(1.27,-3.81) 4(3.81,-3.81) 5(3.81,3.81) 6(1.27,3.81) 7(-1.27,3.81) 8(-3.81,3.81)
DIP-16_L20.0-W6.4-P2.54-LS7.6-BL
  round 1.6 hole 1: 1(-8.89,-3.81) 2(-6.35,-3.81) 3(-3.81,-3.81) 4(-1.27,-3.81) 5(1.27,-3.81) 6(3.81,-3.81) 7(6.35,-3.81) 8(8.89,-3.81) 9(8.89,3.81) 10(6.35,3.81) 11(3.81,3.81) 12(1.27,3.81) 13(-1.27,3.81) 14(-3.81,3.81) 15(-6.35,3.81) 16(-8.89,3.81)
DIP-16_L20.3-W10.2-P2.54-LS10.2-BL
  rect 1.6x1.6 hole 0.9: 1(-8.89,-3.81)
  round 1.6 hole 0.9: 2(-6.35,-3.81) 3(-3.81,-3.81) 4(-1.27,-3.81) 5(1.27,-3.81) 6(3.81,-3.81) 7(6.35,-3.81) 8(8.89,-3.81) 9(8.89,3.81) 10(6.35,3.81) 11(3.81,3.81) 12(1.27,3.81) 13(-1.27,3.81) 14(-3.81,3.81) 15(-6.35,3.81) 16(-8.89,3.81)
HDR-TH_2P-P2.54-V-M
  rect 2x2 hole 1.2: 1(-1.27,0)
  round 2 hole 1.2: 2(1.27,0)
HDR-TH_3P-P2.54-V-M
  rect 1.7x1.7 hole 1.1: 1(-2.54,0)
  round 1.7 hole 1.1: 2(0,0) 3(2.54,0)
Pad_e68
  round 1.524 hole 0.914: 1(0,0)
Pad_e69
  round 1.524 hole 0.914: 2(0,0)
Pad_e70
  round 1.524 hole 0.914: 3(0,0)
Pad_e71
  round 1.524 hole 0.914: 4(0,0)
Pad_e72
  round 1.524 hole 0.914: 5(0,0)
Pad_e478
  round 1.524 hole 0.914: 1(0,0)
Pad_e480
  round 1.524 hole 0.914: 1(0,0)
Pad_e482
  round 1.524 hole 0.914: 1(0,0)
Pad_e493
  round 1.524 hole 0.914: 1(0,0)
Pad_e497
  round 1.524 hole 0.914: 1(0,0)
Pad_e507
  round 1.524 hole 0.914: 1(0,0)
Pad_e1867
  round 1.524 hole 0.914: 1(0,0)
RES-ADJ-TH_3P-L9.5-W4.85-P2.50-BL-BS
  round 1.524 hole 0.762: 1(0,2.5) 2(0,0) 3(0,-2.5)
RES-ADJ-TH_3P-L10.0-W10.0-P2.50-BL-BS
  round 1.524 hole 0.762: 1(0,2.5) 2(0,0) 3(0,-2.5)
RES-ADJ-TH_3P-L10.0-W10.0-P2.50-L
  round 1.524 hole 0.762: 1(-2.5,0) 2(0,0) 3(2.5,0)
Res_1/8W
  round 1.199 hole 0.8: 1(-3.599,0.063) 2(3.599,0.063)
SMA-TH_BWSMA-KE-Z001
  round 2.2 hole 1.5: 1(-2.55,-2.55) 2(-2.55,2.55) 3(2.55,2.55) 4(2.55,-2.55)
  round 2 hole 1.35: 5(0,0)

## Nets
As in the schematic, except:
+5V: C18.1 C22.1 C25.1 H9.3 H13.3 H14.3 NOREF#6.1 NOREF#12.1 P2.3 R17.1 R18.2 R22.2 R23.2 R24.2 U4.16 U5.16
-5V: C19.2 C23.2 C24.2 H14.1 NOREF.1 NOREF#10.1 P2.1 U4.7 U5.7
-12V: C1.2 C3.2 C6.2 C27.2 H1.1 NOREF#8.1 NOREF#11.1 P1.1 U1.4 U2.4 U6.4
GND: C1.1 C2.2 C3.1 C4.1 C5.1 C6.1 C9.1 C18.2 C19.1 C22.2 C23.1 C24.1 C25.2 C26.1 C27.1 H1.2 H2.1 H3.1 H4.1 H9.1 H11.1 H12.2 H13.1 H14.2 H15.2 H16.2 H17.2 H18.1 NOREF#3.1 P1.2 P2.2 R5.1 R13.1 R13.2 R14.1 R14.2 R15.1 R15.2 R16.1 R16.2 R19.1 R27.1 RF2.1 RF2.2 RF2.3 RF2.4 RF3.1 RF3.2 RF3.3 RF3.4 RF4.1 RF4.2 RF4.3 RF4.4 RF5.1 RF5.2 RF5.3 RF5.4 U4.8 U5.8

Pads without a net: NOREF#2 4; NOREF#4 2; NOREF#5 5; NOREF#7 3; NOREF#9 1; U4 1 2 3 4 5 15; U5 1 2 3 4 5

## Via types
v1: diameter 3, hole 0.305, Top Layer to Bottom Layer, 4 vias

## Routing (per net, layer and track width the routed paths; a pad name or vN(x,y) marks a point on that pad's centre or on a via; arc(x,y) is an arc through that point)
+5V: length 220.2
  Top Layer w1.016: NOREF#6.1 67.63,62.68 63.25,58.29 63.25,39.88 NOREF#12.1
  Bottom Layer w1.016: 101.59,66.54 NOREF#6.1 R17.1 62.8,61.71 R18.2 ; 101.59,66.54 102.74,67.69 116.21,67.69 122.17,61.72 122.17,36.07 118.49,32.39 H9.3 116.84,20.45 111.76,15.37 106.34,15.37 C18.1 103.06,18.65 U4.16 ; 101.59,66.54 H14.3 98.64,61.12 P2.3 ; 91.11,44.78 94.53,44.78 97.2,47.45 R24.2 98.64,47.56 P2.3 ; 91.11,44.78 91.12,44.77 R22.2 ; 91.11,44.78 86.73,49.16 H13.3 ; P2.3 91.13,55.88 C25.1 ; NOREF#12.1 67.83,38.99 67.9,38.91 C22.1
+12V: length 120.4
  Bottom Layer w1.016: C2.1 25.96,47.32 24.51,48.77 ; U6.8 C26.2 54.36,21.97 52.2,24.13 52.2,26.42 51.18,27.43 47.75,27.43 46.74,26.42 43.69,26.42 41.91,28.19 41.91,35.43 43.18,36.7 U2.8 C5.2 45.72,42.8 44.45,44.07 42.93,44.07 42.16,44.83 42.16,58.29 39.24,61.21 P1.3 31.49,60.51 H1.3 24.51,48.77 ; 24.51,48.77 23.5,49.78 14.48,49.78 12.06,47.37 C4.2 12.06,41.28 U1.8
-5V: length 98
  Top Layer w1.016: C19.2 105.61,47.29 102.24,50.67 87.63,50.67 85.94,52.37 85.94,56.43 85.22,57.15 81.41,57.15 NOREF.1
  Bottom Layer w0.635: U5.7 74.16,54.24 72.14,56.26 72.14,58.71 C23.2
  Bottom Layer w1.016: NOREF.1 75.45,54.23 U5.7 ; P2.1 114.27,55.88 C24.2 ; P2.1 108.8,47.89 ; P2.1 106.68,58.01 106.68,64.08 ; C19.2 108.8,47.89 ; 108.8,47.89 112.38,47.89 NOREF#10.1 114.3,40.01 112.2,37.91 U4.7
-12V: length 193
  Top Layer w1.016: NOREF#11.1 6.32,13.06 NOREF#8.1
  Bottom Layer w1.016: U6.4 53.72,5.33 C27.2 51.44,2.79 29.08,2.79 25.78,6.1 ; 25.78,6.1 25.78,15.11 31.11,20.45 36.07,20.45 38.1,22.48 C6.2 U2.4 ; 25.78,6.1 22.48,2.79 13.18,2.79 NOREF#11.1 2.79,13.18 2.79,49.66 9.17,56.03 C3.2 11.81,58.55 14.48,61.21 P1.1 21.33,57.02 19.43,55.12 H1.1 ; NOREF#8.1 C1.2 19.43,29.59 U1.4
GND: length 35.1
  Top Layer w0.635: NOREF#3.1 22.69,27.56 10.29,27.56 6.22,31.62 6.22,41.91 C4.1
(no net): length 16
  Bottom Layer w0.635: U5.4 78.58,46.62 NOREF#4.2 ; NOREF#5.5 78.57,39 U5.1 ; U5.5 75.45,49.15 NOREF#9.1 ; NOREF#7.3 78.54,44.08 U5.3 ; NOREF#2.4 78.58,41.54 U5.2
  vias: v1(3,67.74) v1(3,3) v1(127.05,67.74) v1(127.05,3)
0A: length 25.7
  Bottom Layer w0.635: R8.2 48.2,53.53 49.91,55.25 52.18,55.25 R14.3 56.11,55.26 62.22,49.16 U5.12
1A: length 25.3
  Bottom Layer w0.635: U5.14 58.4,44.08 R13.3 56.04,45.72 49.89,45.72 R9.1
2A: length 24.6
  Bottom Layer w0.635: R10.1 48.79,43.28 R15.3 54.39,43.28 56.13,41.53 67.81,41.53 U5.15
3A: length 30.2
  Bottom Layer w0.635: R11.1 48.58,57.09 50.38,58.89 50.38,61.72 51.82,61.72 61.84,51.7 U5.11
A_IN: length 13.9
  Bottom Layer w0.635: H12.1 61.64,56.98 R18.1 67.54,54.51 U5.10
B_IN: length 7.5
  Bottom Layer w0.635: H11.2 69.85,58.81 U5.9 67.77,56.73 R17.2
DAC_INPUT: length 13.2
  Bottom Layer w0.635: H2.2 19.58,20.09 H5.2
DAC_LINE: length 61.5
  Bottom Layer w0.635: U4.13 99.25,30.29 97.54,28.58 97.54,25.65 95.63,23.75 67.44,23.75 59.69,31.5 C28.2 56.18,31.41 R28.2
DDS_INPUT: length 20.8
  Bottom Layer w0.635: H18.2 RF5.5 95.47,29.05 99.25,32.83 U4.12
FILTER_OUTPUT: length 55.7
  Bottom Layer w0.635: C10.2 6.48,35.31 9.53,38.35 13.59,38.35 14.35,39.12 U1.7 16.89,41.02 16.89,47.12 17.65,47.88 21.08,47.88 21.84,47.12 21.84,33.66 26.92,28.58 28.96,28.58 H10.2
OUTPUT: length 27.1
  Bottom Layer w0.635: R26.2 61.82,13.62 U6.7 ; R26.2 R26.1 ; R26.2 78.98,13.62 RF3.5 85.68,13.64 H3.2
SELECT_A: length 17.7
  Bottom Layer w0.635: H15.1 89.97,34.59 R22.1 102.69,35.74 U4.11
SELECT_B: length 17.7
  Bottom Layer w0.635: U4.10 94.86,37.91 94.59,37.64 87.25,37.64 H16.1
SELECT_C: length 18.5
  Bottom Layer w0.635: H17.1 89.34,40.25 R24.1 102.86,40.25 U4.9
SIGNAL: length 55.3
  Bottom Layer w0.635: U4.14 101.03,27.75 100.08,26.8 100.08,16.89 92.2,9.02 U6.5
VBIAS_INPUT: length 24.7
  Bottom Layer w0.635: U6.3 53.46,11.29 H4.2
$1N2172: length 6.1
  Bottom Layer w0.635: R2.1 14.35,31.34 U1.2 U1.1
$1N2176: length 6.8
  Bottom Layer w0.635: C10.1 6.5,23.06 R3.1 R2.2
$1N2201: length 24.7
  Bottom Layer w0.635: R3.2 9.02,31.34 9.02,34.42 10.8,36.2 18.42,36.2 19.43,37.21 U1.5 19.43,45.72 19.43,45.72
$1N2440: length 13.3
  Bottom Layer w0.635: H5.1 16.89,20.45 16.89,33.4
$1N4655: length 12.5
  Bottom Layer w0.635: U2.2 37.93,34.33 R7.3 29.76,33.97 R5.2
$1N4662: length 30.9
  Bottom Layer w0.635: R7.1 R7.2 37.97,36.83 U2.1 38.18,36.79 R10.2 R9.2 R8.1 R11.2
$1N4663: length 8
  Bottom Layer w0.635: C28.1 45.85,31.5 U2.6 U2.7
$1N4664: length 24
  Bottom Layer w0.635: 22.22,20.19 26.8,20.19 31.62,25.02 31.62,30.86 32.39,31.62 U2.3
$1N4683: length 6.3
  Bottom Layer w0.635: U4.6 116.4,35.37 H9.2
$1N5505: length 6.8
  Bottom Layer w0.635: U5.6 H13.2
$1N6257: length 47.5
  Bottom Layer w0.635: U2.5 52.45,29.08 53.09,29.72 53.09,32.89 54.99,34.8 61.47,34.8 64.01,32.26 69.98,32.26 71.5,33.78 71.5,45.34 70.22,46.62 U5.13
$1N7259: length 9.1
  Bottom Layer w0.635: R19.2 53.69,14.13 U6.2
$1N7273: length 12.9
  Bottom Layer w0.635: R28.1 48.9,24.56 R20.1 R20.2 U6.1
$1N8069: length 10.7
  Bottom Layer w0.635: U6.6 61.78,11.12 R26.3 71.81,11.12 R27.2

## Copper pours and planes (outline as drawn; the poured copper is in the pictures)
GND on Bottom Layer: 0,70.74 130.05,70.74 130.05,0 0,0
